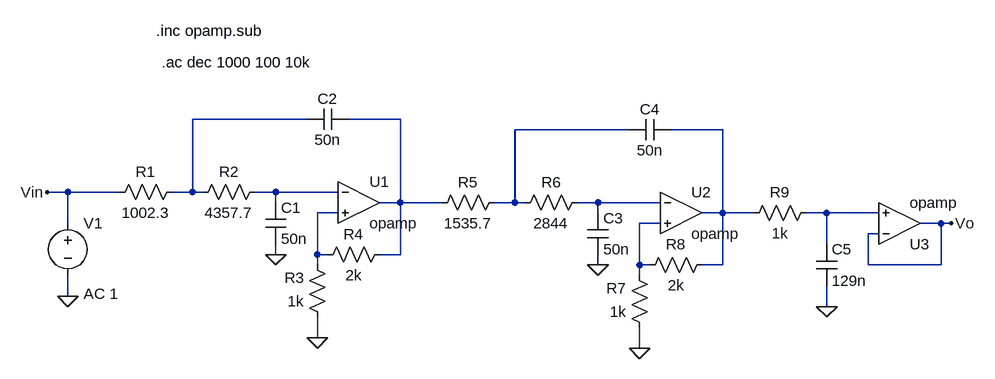
[diagram p0: schematic ej2-TP2.asc]
ej2-TP2.asc, the LTspice schematic file:
Version 4
SHEET 1 1232 680
WIRE -32 48 -208 48
WIRE 112 48 32 48
WIRE 464 64 288 64
WIRE 608 64 528 64
WIRE -400 160 -432 160
WIRE -320 160 -400 160
WIRE -208 160 -208 48
WIRE -208 160 -240 160
WIRE -192 160 -208 160
WIRE -80 160 -112 160
WIRE 16 160 -80 160
WIRE -80 176 -80 160
WIRE 112 176 112 48
WIRE 112 176 80 176
WIRE 176 176 112 176
WIRE 288 176 288 64
WIRE 288 176 256 176
WIRE 304 176 288 176
WIRE 416 176 384 176
WIRE 512 176 416 176
WIRE 16 192 -16 192
WIRE 416 192 416 176
WIRE 608 192 608 64
WIRE 608 192 576 192
WIRE 656 192 608 192
WIRE 768 192 736 192
WIRE 848 192 768 192
WIRE -400 208 -400 160
WIRE 512 208 480 208
WIRE 944 208 912 208
WIRE 960 208 944 208
WIRE 848 224 832 224
WIRE 768 240 768 192
WIRE -80 256 -80 240
WIRE -16 256 -16 192
WIRE 0 256 -16 256
WIRE 112 256 112 176
WIRE 112 256 80 256
WIRE -16 272 -16 256
WIRE 416 272 416 256
WIRE 480 272 480 208
WIRE 496 272 480 272
WIRE 608 272 608 192
WIRE 608 272 576 272
WIRE 832 272 832 224
WIRE 944 272 944 208
WIRE 944 272 832 272
WIRE 480 288 480 272
WIRE -400 320 -400 288
WIRE 768 336 768 304
WIRE -16 384 -16 352
WIRE 480 400 480 368
FLAG -80 256 0
FLAG -16 384 0
FLAG -400 320 0
FLAG 416 272 0
FLAG 480 400 0
FLAG 768 336 0
FLAG 960 208 Vo
FLAG -432 160 Vin
SYMBOL Opamps\\opamp 48 112 R0
SYMATTR InstName U1
SYMBOL res -224 144 R90
WINDOW 0 0 56 VBottom 2
WINDOW 3 32 56 VTop 2
SYMATTR InstName R1
SYMATTR Value 1002.3
SYMBOL res -96 144 R90
WINDOW 0 0 56 VBottom 2
WINDOW 3 32 56 VTop 2
SYMATTR InstName R2
SYMATTR Value 4357.7
SYMBOL res 0 368 R180
WINDOW 0 36 76 Left 2
WINDOW 3 36 40 Left 2
SYMATTR InstName R3
SYMATTR Value 1k
SYMBOL res -16 272 R270
WINDOW 0 32 56 VTop 2
WINDOW 3 0 56 VBottom 2
SYMATTR InstName R4
SYMATTR Value 2k
SYMBOL cap -96 176 R0
SYMATTR InstName C1
SYMATTR Value 50n
SYMBOL cap 32 32 R90
WINDOW 0 0 32 VBottom 2
WINDOW 3 32 32 VTop 2
SYMATTR InstName C2
SYMATTR Value 50n
SYMBOL voltage -400 192 R0
WINDOW 123 24 124 Left 2
WINDOW 39 0 0 Left 0
SYMATTR Value2 AC 1
SYMATTR InstName V1
SYMATTR Value ""
SYMBOL Opamps\\opamp 544 128 R0
SYMATTR InstName U2
SYMBOL res 272 160 R90
WINDOW 0 0 56 VBottom 2
WINDOW 3 32 56 VTop 2
SYMATTR InstName R5
SYMATTR Value 1535.7
SYMBOL res 400 160 R90
WINDOW 0 0 56 VBottom 2
WINDOW 3 32 56 VTop 2
SYMATTR InstName R6
SYMATTR Value 2844
SYMBOL res 496 384 R180
WINDOW 0 36 76 Left 2
WINDOW 3 36 40 Left 2
SYMATTR InstName R7
SYMATTR Value 1k
SYMBOL res 480 288 R270
WINDOW 0 32 56 VTop 2
WINDOW 3 0 56 VBottom 2
SYMATTR InstName R8
SYMATTR Value 2k
SYMBOL cap 400 192 R0
SYMATTR InstName C3
SYMATTR Value 50n
SYMBOL cap 528 48 R90
WINDOW 0 0 32 VBottom 2
WINDOW 3 32 32 VTop 2
SYMATTR InstName C4
SYMATTR Value 50n
SYMBOL res 752 176 R90
WINDOW 0 0 56 VBottom 2
WINDOW 3 32 56 VTop 2
SYMATTR InstName R9
SYMATTR Value 1k
SYMBOL cap 752 240 R0
SYMATTR InstName C5
SYMATTR Value 129n
SYMBOL Opamps\\opamp 880 272 M180
SYMATTR InstName U3
TEXT -264 -88 Left 2 !.inc opamp.sub
TEXT -256 -40 Left 2 !.ac dec 1000 100 10k

The netlist it stands for:
* ej2-TP2.asc
XU1 N005 N007 N002 opamp Aol=100K GBW=10Meg  ; pins invin noninvin out
R1 N001 Vin 1002.3
R2 N005 N001 4357.7
R3 0 N007 1k
R4 N007 N002 2k
C1 N005 0 50n
C2 N002 N001 50n
V1 Vin 0 AC 1
XU2 N006 N009 N004 opamp Aol=100K GBW=10Meg  ; pins invin noninvin out
R5 N003 N002 1535.7
R6 N006 N003 2844
R7 0 N009 1k
R8 N009 N004 2k
C3 N006 0 50n
C4 N004 N003 50n
R9 N008 N004 1k
C5 N008 0 129n
XU3 Vo N008 Vo opamp Aol=100K GBW=10Meg  ; pins invin noninvin out
.inc opamp.sub
.ac dec 1000 100 10k
.backanno
.end